# Altium schematic sheet CPU.SchDoc: WZ1262 - WIZnet Connect the Magic 2014 Design Challenge
size A4; DocumentNumber: 1; Revision: 1.0; SheetNumber: 1; SheetTotal: 4; PageSetup: Record=PageOptions|CenterHorizontal=True|CenterVertical=True|PrintScale=0.31|XCorrection=1.00|YCorrection=1.00|PrintKind=1|BorderSize=5000000|LeftOffset=0|BottomOffset=0|Orientation=2|PaperLength=1000|PaperWidth=1000|Scale=100|PaperSource=7|PrintQuality=600|MediaType=1|DitherType=10|PrintScaleMode=1|PaperKind=A4 (210 x 297mm)|PaperIndex=9
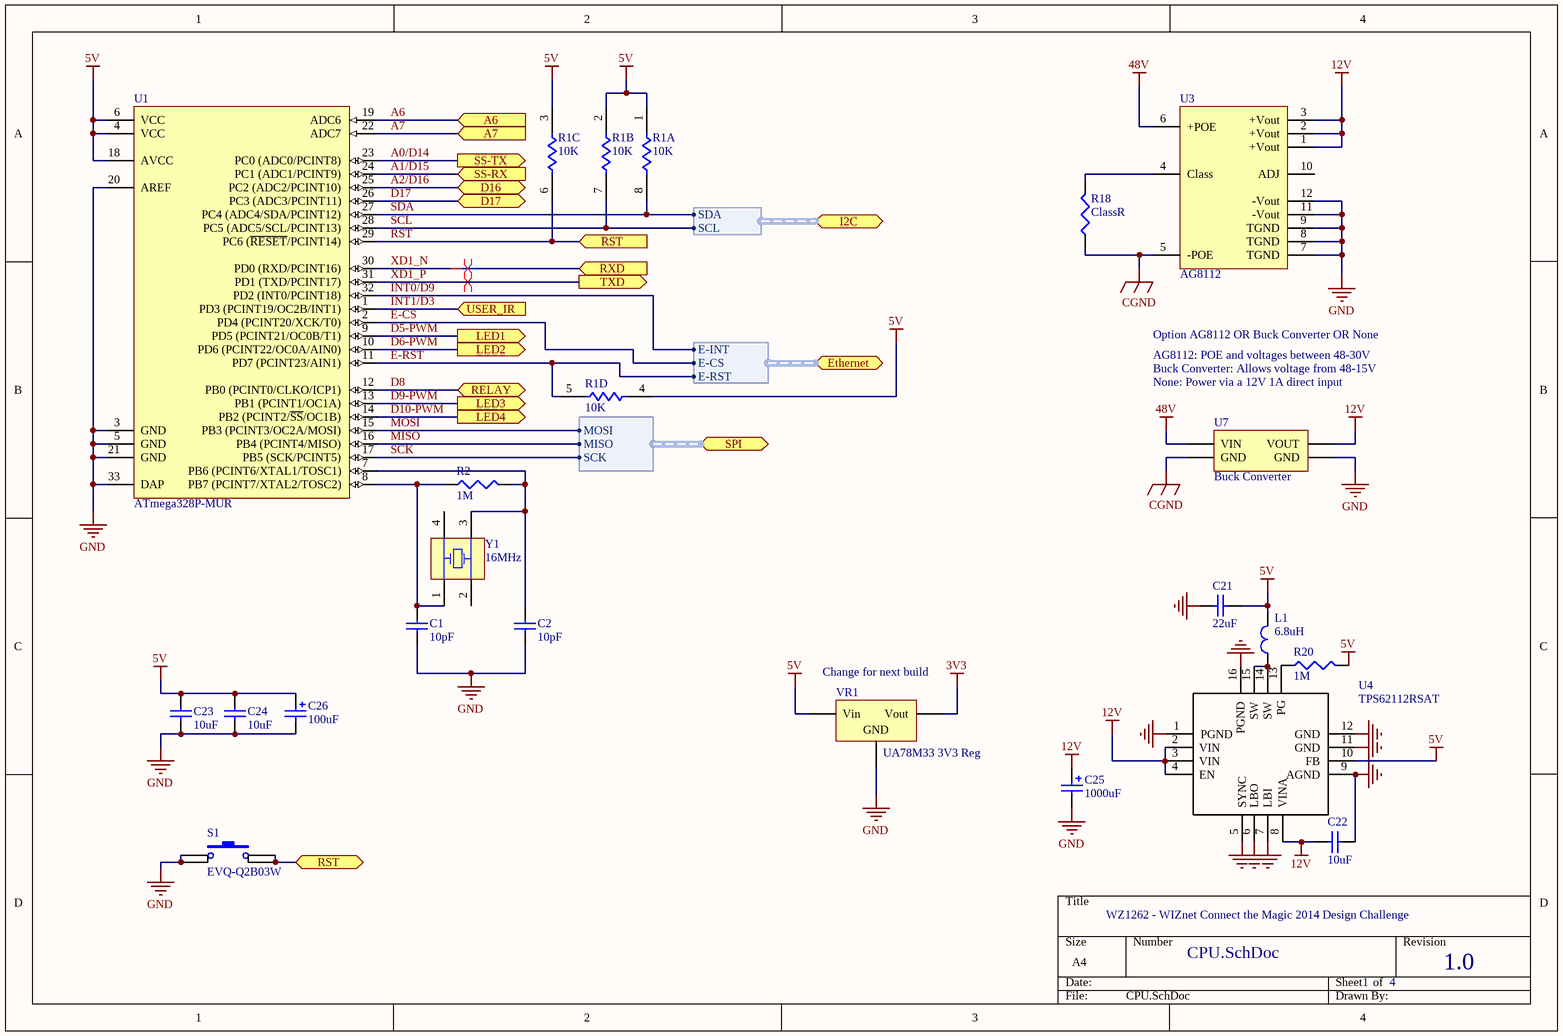
[diagram p0: CPU.SchDoc]

## Parts
C1  10pF  [0603]
C2  10pF  [0603]
C21  22uF  [1210]
C22  10uF  [0603]
C23  10uF  [0603]
C24  10uF  [0603]
C25  1000uF  [PANASONIC_H13]
C26  100uF  [PANASONIC_C]
L1  6.8uH  [1812]
R1  10K  [SO8_S]  (parts A,B,C,D of 4)
R2  1M  [0603]
R18  ClassR  [0603]  (no BOM)
R20  1M  [0603]
S1  EVQ-Q2B03W  [TACTILE_SWITCH_SMD]
U1  ATmega328P-MUR  [32M1-A_N]
U3  AG8112  [AG8100]
U4  TPS62112RSAT  [16-QFN]
U7  Buck Converter  [Buck_Module]
VR1  UA78M33 3V3 Reg  [SOT223]
Y1  16MHz  [CRYSTAL-SMD-2.5X2-ABM10]

## Ports
A6 (in), A7 (in), D16, D17, Ethernet (harness Ethernet), I2C (harness I2C), LED1 (out), LED2 (out), LED3 (out), LED4 (out), RELAY, RST, RST (in), RXD (in), SPI (harness SPI), SS-RX (in), SS-TX (out), TXD (out), USER_IR (in)

## Harnesses
SPI: SCK, MISO, MOSI
Ethernet: E-CS, E-INT, E-RST
I2C: SDA, SCL

## Nets
3V3: VR1.3(Vout)
5V: C21.2 C23.2 C24.2 C26.+ L1.2 R1.1 R1.2 R1.3 R1.4 R20.2 U1.4(VCC) U1.6(VCC) U1.18(AVCC) U4.10(FB) VR1.1(Vin)
12V: C22.1 C25.+ U3.1(+Vout) U3.2(+Vout) U3.3(+Vout) U4.2(VIN) U4.3(VIN) U4.4(EN) U4.8(VINA) U7.2(VOUT)
48V: U3.6(+POE) U7.1(VIN)
CGND: R18.1 U3.5(-POE) U7.4(GND)
GND: C1.1 C2.1 C21.1 C22.2 C23.1 C24.1 C25.- C26.- S1.1 S1.2 U1.3(GND) U1.5(GND) U1.20(AREF) U1.21(GND) U1.33(DAP) U3.7(TGND) U3.8(TGND) U3.9(TGND) U3.11(-Vout) U3.12(-Vout) U4.0(GND) U4.1(PGND) U4.5(SYNC) U4.6(LBO) U4.7(LBI) U4.9(AGND) U4.11(GND) U4.12(GND) U4.16(PGND) U7.3(GND) VR1.2(GND)
A0/D14: U1.23(PC0_(ADC0/PCINT8)) ; port SS-TX
A1/D15: U1.24(PC1_(ADC1/PCINT9)) ; port SS-RX
A2/D16: U1.25(PC2_(ADC2/PCINT10)) ; port D16
A6: U1.19(ADC6) ; port A6
A7: U1.22(ADC7) ; port A7
D5-PWM: U1.9(PD5_(PCINT21/OC0B/T1)) ; port LED1
D6-PWM: U1.10(PD6_(PCINT22/OC0A/AIN0)) ; port LED2
D8: U1.12(PB0_(PCINT0/CLKO/ICP1)) ; port RELAY
D9-PWM: U1.13(PB1_(PCINT1/OC1A)) ; port LED3
D10-PWM: U1.14(PB2_(PCINT2/~{SS}/OC1B)) ; port LED4
D17: U1.26(PC3_(ADC3/PCINT11)) ; port D17
E-CS: U1.2(PD4_(PCINT20/XCK/T0)) ; port Ethernet.E-CS
E-RST: R1.5 U1.11(PD7_(PCINT23/AIN1)) ; port Ethernet.E-RST
INT0/D9: U1.32(PD2_(INT0/PCINT18)) ; port Ethernet.E-INT
INT1/D3: U1.1(PD3_(PCINT19/OC2B/INT1)) ; port USER_IR
MISO: U1.16(PB4_(PCINT4/MISO)) ; port SPI.MISO
MOSI: U1.15(PB3_(PCINT3/OC2A/MOSI)) ; port SPI.MOSI
RST: R1.6 S1.3 S1.4 U1.29(PC6_(~{RESET}/PCINT14)) ; port RST
SCK: U1.17(PB5_(SCK/PCINT5)) ; port SPI.SCK
SCL: R1.7 U1.28(PC5_(ADC5/SCL/PCINT13)) ; port I2C.SCL
SDA: R1.8 U1.27(PC4_(ADC4/SDA/PCINT12)) ; port I2C.SDA
XD1_N: U1.30(PD0_(RXD/PCINT16)) ; port RXD
XD1_P: U1.31(PD1_(TXD/PCINT17)) ; port TXD
NetC1_2: C1.2 R2.1 U1.8(PB7_(PCINT7/XTAL2/TOSC2)) Y1.1(OSC1)
NetC2_2: C2.2 R2.2 U1.7(PB6_(PCINT6/XTAL1/TOSC1)) Y1.3(OSC2)
NetL1_1: L1.1 U4.14(SW) U4.15(SW)
NetR18_2: R18.2 U3.4(Class)
NetR20_1: R20.1 U4.13(PG)

Not connected (* = marked no-connect by the designer): U3 10(ADJ); Y1 2(OSC2) 4(OSC1)

## Layout directives
differential pair: XD1_N, XD1_P

## Notes on the sheet
- Option AG8112 OR Buck Converter OR None
- AG8112: POE and voltages between 48-30V
- Buck Converter: Allows voltage from 48-15V
- None: Power via a 12V 1A direct input
- (near VR1) Change for next build

## Library data of the parts
C1 C2 = Cap_10pF: Capacitor (Semiconductor SIM Model); Published: 8-Jun-2000; LatestRevisionDate: 29-May-2009; LatestRevisionNote: IPC-7351 Footprint Added.; PackageReference: C1206; Publisher: Altium Limited; PackageDescription: Chip Capacitor; Value: 10pF; Supplier 1: Digi-Key; Supplier 2: Mouser; Supplier Part Number 1: 1276-2157-1-ND; Supplier Part Number 2: 80-C0603C100K3G
C21 = Cap_22uF: Capacitor (Semiconductor SIM Model); Published: 8-Jun-2000; LatestRevisionDate: 29-May-2009; LatestRevisionNote: IPC-7351 Footprint Added.; PackageReference: C1206; Publisher: Altium Limited; PackageDescription: Chip Capacitor; Value: 22uF; Supplier 1: Digi-Key; Supplier 2: Mouser; Supplier Part Number 1: 587-1395-1-ND; Supplier Part Number 2: 963-LMK325F226ZN-T
C22-C24 = Cap_10uF: Capacitor (Semiconductor SIM Model); Value: 10uF - 25V; Published: 8-Jun-2000; LatestRevisionDate: 29-May-2009; LatestRevisionNote: IPC-7351 Footprint Added.; PackageReference: C1206; Publisher: Altium Limited; PackageDescription: Chip Capacitor; Supplier 1: Digi-Key; Supplier 2: Mouser; Supplier Part Number 1: 445-9015-1-ND; Supplier Part Number 2: 810-C1608X5R1E106M
C25 = Cap_Polarized_1000uF: Polarized Capacitor (Surface Mount); Published: 8-Jun-2000; LatestRevisionDate: 29-May-2009; LatestRevisionNote: IPC-7351 Footprint Added.; PackageReference: C0805; Publisher: Altium Limited; PackageDescription: Chip Capacitor; Value: 1000uF; Supplier 1: Digi-Key; Supplier 2: Mouser; Supplier Part Number 1: PCE3462CT-ND; Supplier Part Number 2: 140-VE102M1ETR1313
C26 = Cap_Polarized_100uF: Polarized Capacitor (Surface Mount); Published: 8-Jun-2000; LatestRevisionDate: 29-May-2009; LatestRevisionNote: IPC-7351 Footprint Added.; PackageReference: C0805; Publisher: Altium Limited; PackageDescription: Chip Capacitor; Value: 100uF; Supplier 1: Digi-Key; Supplier 2: Mouser; Supplier Part Number 1: PCE4718CT-ND; Supplier Part Number 2: 667-EEE-HAJ101WAR
L1 = INDUCTOR: INDUCTOR WW 6.8UH 1.1A 1812 SMD; MPN: LQH43CN6R8M03L; SPN: 732-4064-6-ND; Cost10: 1.68800; Cost100: 1.28250; Supplier: Digikey; Supplier 1: Digi-Key; Supplier 2: Mouser; Supplier Part Number 1: 490-2518-1-ND; Supplier Part Number 2: 81-LQH43CN6R8M03L
R1 = Resistor_Pack_10K: Isolated Resistor Network - Parts; Sim Note: Enter the Resistance value into parameter field.; Published: 24-Mar-1999; LatestRevisionDate: 29-May-2009; LatestRevisionNote: IPC-7351 Footprint Added.; PackageReference: SOIC16; Publisher: Altium Limited; PackageDescription: 16-Pin Small Outline Integrated Circuit 1.27 mm Pitch; Code_JEDEC: MS-012-AC; Code_IPC: SOIC127P600-16; Value: 10K; Supplier 1: Digi-Key; Supplier 2: Mouser; Supplier Part Number 1: 742C083103JPCT-ND; Supplier Part Number 2: 774-742C083103JP
R2 R20 = Resistor_1M: Resistor; Published: 8-Jun-2000; LatestRevisionDate: 29-May-2009; LatestRevisionNote: IPC-7351 Footprint Added.; PackageReference: J1-0603; Publisher: Altium Limited; PackageDescription: Chip Resistor; Value: 1M; Supplier 1: Digi-Key; Supplier 2: Mouser; Supplier Part Number 1: 311-1MLMCT-ND; Supplier Part Number 2: 603-AF0603FR-071ML
R18 = Resistor: Value: ??; Published: 8-Jun-2000; LatestRevisionDate: 29-May-2009; LatestRevisionNote: IPC-7351 Footprint Added.; PackageReference: J1-0603; Publisher: Altium Limited; PackageDescription: Chip Resistor; Supplier 1: Digi-Key; Supplier 2: Mouser
S1 = SW-PB: Switch; Published: 24-Mar-1999; LatestRevisionDate: 17-Jul-2002; LatestRevisionNote: Re-released for DXP Platform.; PackageReference: SPST-2; Publisher: Altium Limited; PackageDescription: Switch; 2 Leads; Supplier 1: Digi-Key; Supplier 2: Mouser; Supplier Part Number 1: P12932SCT-ND; Supplier Part Number 2: 667-EVQ-Q2B03W
U1 = ATmega328P-MUR: 8-bit AVR Microcontroller, 32KB Flash, 1KB EEPROM, 2KB SRAM, 32-pin MLF, Industrial Grade (-40°C to 85°C); Published: 1-Apr-2010; DatasheetVersion: revA, Jan-2010; PackageVersion: revE, May-2006; PackageReference: 32M1-A; Publisher: Altium Limited; PackageDescription: 32-Pin Micro Lead Frame Package (MLF),  5 x 5 x 1.0 mm Body, Pitch 0.50 mm, 3.10mm Exposed Pad; Supplier 1: Digi-Key; Supplier Part Number 1: ATMEGA328P-MURCT-ND; Supplier 2: Mouser; Supplier Part Number 2: 556-ATMEGA328P-MU; Code_JEDEC: MO-220-VHHD-2; ComponentLink1Description: Manufacturer Link; ComponentLink1URL: http://www.atmel.com/products/avr/default.asp?; ComponentLink2Description: ATmega48A/48PA/88A/88PA/168A/168PA/328/328P Datasheet; ComponentLink2URL: http://www.atmel.com/dyn/resources/prod_documents/8271.pdf; ComponentLink3Description: ATmega48A/48PA/88A/88PA/168A/168PA/328/328P Summary; ComponentLink3URL: http://www.atmel.com/dyn/resources/prod_documents/8271S.pdf; ComponentLink4Description: Atmel.com Home; ComponentLink4URL: http://www.atmel.com
U3 = AG8100: POE Controller and Buck Converter
U4 = TPS62112RSAT: IC REG BUCK SYNC 5V 1.5A 16QFN; SPN: 296-19717-6-ND; Cost10: 3.83100; Cost100: 2.00480; MPN: TPS62112RSAT; Supplier: Digikey; Supplier 1: Digi-Key; Supplier 2: Mouser; Supplier Part Number 1: 296-19717-1-ND; Supplier Part Number 2: 595-TPS62112RSAT
U7 = Buck: Adjustable Buck Converter Module; LatestRevisionDate: 17-Jul-2002; LatestRevisionNote: Re-released for DXP Platform.; Publisher: Altium Limited
VR1 = Volt Reg: Voltage Regulator; Published: 24-Mar-1999; LatestRevisionDate: 29-May-2009; LatestRevisionNote: IPC-7351 Footprint Added.; PackageReference: D2PAK; Publisher: Altium Limited; PackageDescription: 3-Pin Transistor Outline Package 2.54 mm Pitch, 15.1 mm Lead Span; Part: UA78M33; Supplier 1: Digi-Key; Supplier 2: Mouser; Supplier Part Number 1: 296-27140-5-ND; Supplier Part Number 2: 595-UA78M33CDCY
Y1 = Crystal_16MHz: Surface Mount Quartz Crystal; Note: PCB layout complies with manufacturer's recommendation.; Published: 17-Jul-2002; DatasheetDocument: 28-Aug-2001; PackageDocument: 28-Aug-2001; PackageReference: 91SMX; Publisher: Altium Limited; ComponentLink1Description: Manufacturer Link; ComponentLink1URL: http://www.cmac.com/mt/; ComponentLink2Description: Datasheet; ComponentLink2URL: http://www.cmac.com/mt/databook/crystals/smd/90_91_smx.pdf; Value: 16MHz; Supplier 1: Digi-Key; Supplier 2: Mouser; Supplier Part Number 1: 1253-1122-1-ND; Supplier Part Number 2: 732-FA20H-16F12Z-AC3